# EAGLE design ssslidar_v1.0_blade_PWR_top (EAGLE 7.6.0)
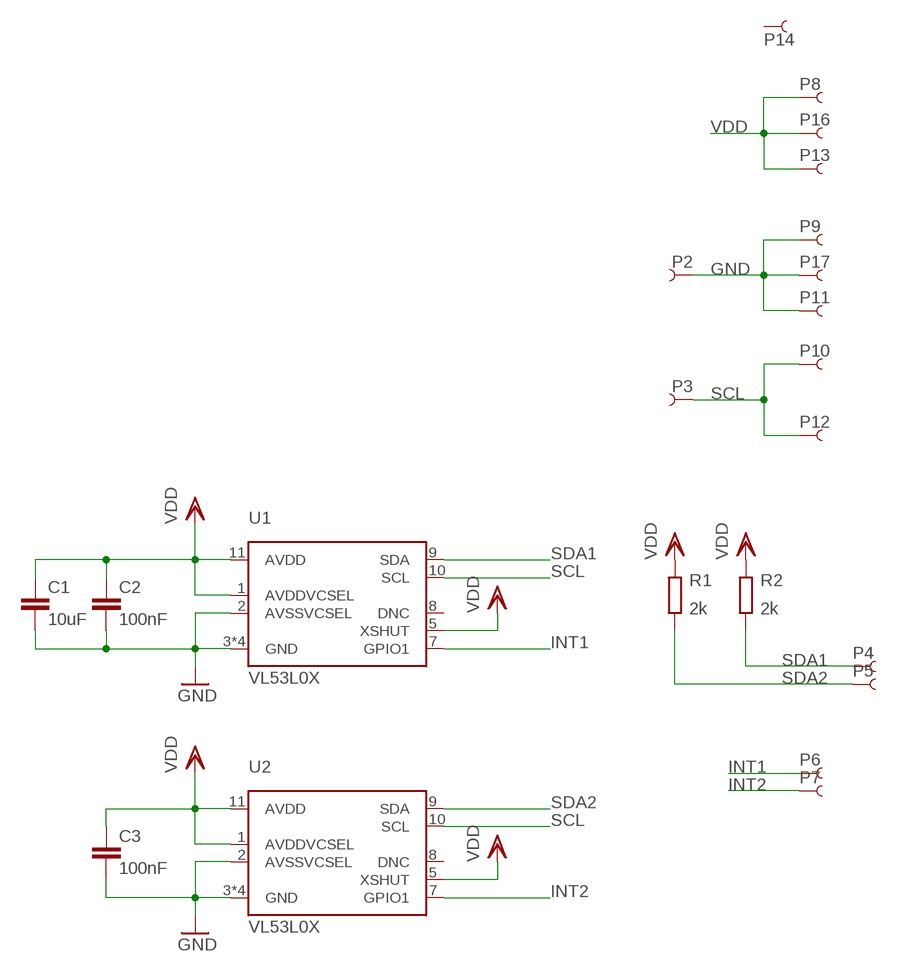
[diagram p0: schematic, sheet 1]

## Parts
C1  10uF  C0805  [0805_N]
C2  100nF  C0402  [0402_N]
C3  100nF  C0402  [0402_N]
P2  PIN_SMD_1X1_RECT  [PIN_SMD_1X1_RECT]
P3  PIN_SMD_0.8X1_RECT  [PIN_SMD_0.8X1_RECT]
P4  PIN_SMD_0.8X1_RECT  [PIN_SMD_0.8X1_RECT]
P5  PIN_SMD_0.8X1_RECT  [PIN_SMD_0.8X1_RECT]
P6  PIN_SMD_0.8X1_RECT  [PIN_SMD_0.8X1_RECT]
P7  PIN_SMD_0.8X1_RECT  [PIN_SMD_0.8X1_RECT]
P8  PIN_SMD_0.8X1_RECT  [PIN_SMD_0.8X1_RECT]
P9  PIN_SMD_1X1_RECT  [PIN_SMD_1X1_RECT]
P10  PIN_SMD_1X1_RECT  [PIN_SMD_1X1_RECT]
P11  PIN_SMD_1X2  [PIN_SMD_1X2]
P12  PIN_SMD_1X1_RECT  [PIN_SMD_1X1_RECT]
P13  PIN_SMD_1X1_RECT  [PIN_SMD_1X1_RECT]
P14  PIN_SMD_0.8X1_RECT  [PIN_SMD_0.8X1_RECT]
P16  PIN_SMD_1X1_RECT  [PIN_SMD_1X1_RECT]
P17  PIN_SMD_1X2  [PIN_SMD_1X2]
R1  2k  R0402  [0402_N]
R2  2k  R0402  [0402_N]
U1  VL53L0X  [VL53L0X]
U2  VL53L0X  [VL53L0X]

## Nets
GND: C1.2 C2.2 C3.2 P2.PIN P9.PIN P11.P$1 P17.P$1 U1.2(AVSSVCSEL) U1.3(GND) U1.4(GND) U1.6(GND) U1.12(GND) U2.2(AVSSVCSEL) U2.3(GND) U2.4(GND) U2.6(GND) U2.12(GND)
INT1: P6.PIN U1.7(GPIO1)
INT2: P7.PIN U2.7(GPIO1)
SCL: P3.PIN P10.PIN P12.PIN U1.10(SCL) U2.10(SCL)
SDA1: P4.PIN R2.1 U1.9(SDA)
SDA2: P5.PIN R1.1 U2.9(SDA)
VDD: C1.1 C2.1 C3.1 P8.PIN P13.PIN P16.PIN R1.2 R2.2 U1.1(AVDDVCSEL) U1.5(XSHUT) U1.11(AVDD) U2.1(AVDDVCSEL) U2.5(XSHUT) U2.11(AVDD)
Unconnected: P14.PIN U1.8(DNC) U2.8(DNC)

## Library data of the parts
C1-C3 = Xevelabs:C: Non-polarized Capacitor
P2-P14 P16 P17 = Xevelabs:PIN
R1 R2 = Xevelabs:R: Resistor
U1 U2 = VL53L0X:VL53L0X: VL53L0X distance sensor

## Board
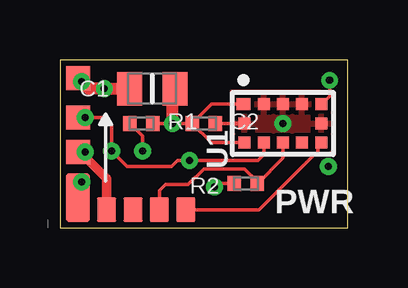
[diagram p1: board, top side]
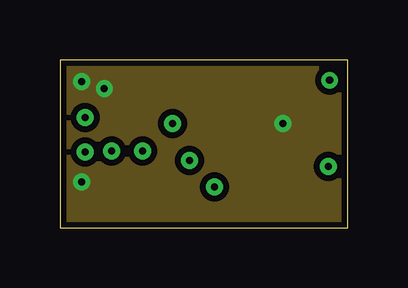
[diagram p2: board, inner layer Route2]
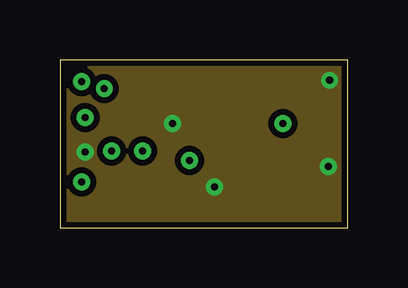
[diagram p3: board, inner layer Route3]
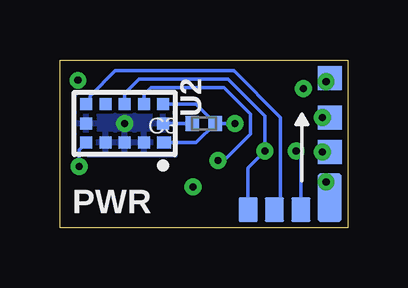
[diagram p4: board, bottom side, seen from below]

Size 12 x 7 mm. Coordinates in mm from the lower left corner, seen from the top.
Outline: 0,0 12,0 12,7 0,7 0,0
Copper layers (1*2*3*16): Top 0.035mm / dielectric 0.15mm / Route2 0.035mm / dielectric 1.1mm / Route3 0.035mm / dielectric 0.15mm / Bottom 0.035mm
Design rules "Xevelabs_6mil_4layers_eurocircuits": minimum track width 0.15mm, minimum drill 0.25mm, track to track 0.155mm, track to pad 0.155mm, pad to pad 0.155mm, via to via 0.155mm, smd to smd 0mil, copper to edge 0.25mm, drill to drill 0.25mm, minimum pad ring 0.15mm, minimum via ring 0.2mm, stop-mask expansion 0mil, vias tented up to drill 100mil, thermal gap 0.2mm

### Footprints (pad centres in the part's own frame; a part is rotated, then mirrored left to right if it is on the bottom)
0805_N = smd 1.05 x 1.4: 1 -0.95,0; 2 0.95,0
0402_N = smd 0.57 x 0.62: 1 -0.48,0; 2 0.48,0
PIN_SMD_1X1_RECT = smd 1 x 1: PIN 0,0
PIN_SMD_0.8X1_RECT = smd 1 x 0.8: PIN 0,0
PIN_SMD_1X2 = smd 2 x 1: P$1 0,0
VL53L0X = smd 0.5 x 0.58: 1 0.8,1.64 | smd 0.5 x 0.5: 2 0.8,0.8; 3 0.8,0; 4 0.8,-0.8; 5 0.8,-1.6; 6 0,-1.6; 7 -0.8,-1.6; 8 -0.8,-0.8; 9 -0.8,0; 10 -0.8,0.8; 11 -0.8,1.6; 12 0,1.6

### Placement (x,y rotation side)
C1  3.85,5.8 180 top
C2  6,4.35 0 top
C3  6,4.35 180 bottom
P2  0.75,6.25 90 bottom
P3  1.95,0.75 90 bottom
P4  4.15,0.75 90 top
P5  4.15,0.75 90 bottom
P6  5.25,0.75 90 top
P7  3.05,0.75 90 bottom
P8  1.95,0.75 90 top
P9  0.75,6.25 0 top
P10  0.75,4.6 180 bottom
P11  0.75,1.25 270 top
P12  0.75,4.6 0 top
P13  0.75,3.15 0 bottom
P14  3.05,0.75 90 top
P16  0.75,3.15 180 top
P17  0.75,1.25 270 bottom
R1  3.4,4.35 0 top
R2  7.75,1.85 180 top
U1  9.3,4.35 90 top
U2  9.3,4.35 270 bottom

### Tracks (layer width: path | path; a pad name or v marks a point on that pad's centre or on a via)
GND  (via drill 0.3)
  Top 0.15: P9.PIN v0.9,6.1 | C3.2 U2.12 | v0.9,1.9 0.9,1.4 P11.P$1
  Top 0.5: C1.2 v1.85,5.8 1.2,5.8 v0.9,6.1
  Bottom 0.15: P9.PIN v0.9,6.1 | U2.12 C3.2 | v0.9,1.9 0.9,1.4 P11.P$1
  other vias: 9.3,4.35
  pour Route2 (isolate 0.254): 0,7 12,7 12,0 0,0
  pour Top: 11.45,5.7 7.15,5.7 7.15,3 11.45,3
  pour Bottom: 11.45,5.7 7.15,5.7 7.15,3 11.45,3
INT1
  Top 0.15: U1.7 10.75,3.4 10.75,3.1 10.65,3.1 8.3,0.75 P6.PIN
INT2
  Bottom 0.15: U2.7 10.75,5.3 10.75,5.5 9.7,6.55 4.75,6.55 2.8,4.6 2.8,1 P7.PIN
SCL  (via drill 0.3)
  Top 0.15: P12.PIN v1.05,4.6 1.85,4.6 2.15,4.3 v2.15,3.2 2.8,2.55 4.65,2.55 4.9,2.8 v5.4,2.8 8.25,2.8 8.5,3.05 U1.10
  Bottom 0.15: P12.PIN v1.05,4.6 | U2.10 8.5,5.55 8.2,5.85 5.15,5.85 4.05,4.75 4.05,3.9 5.15,2.8 v5.4,2.8 | P3.PIN 1.95,3 v2.15,3.2
SDA1
  Top 0.15: U1.9 9.3,2.9 8.25,1.85 R2.1 8.23,1.92 7.7,2.45 6,2.45 5.35,1.8 4.4,1.8 4.15,1.55 P4.PIN
SDA2  (via drill 0.3)
  Top 0.15: R1.1 3.45,3.82 v3.45,3.2
  Bottom 0.15: U2.9 9.3,5.6 8.7,6.2 5,6.2 3.45,4.65 v3.45,3.2 4.15,2.5 P5.PIN
VDD  (via drill 0.3)
  Top 0.15: v1.05,3.15 P13.PIN | v11.25,6.15 11.25,5.5 U1.5 | 4.8,5.68 C1.1 | v6.45,1.7 6.6,1.85 R2.2 | U1.11 6.32,3.55 C3.1 | C3.1 v4.7,4.35 R1.2 | C3.1 6.32,5.15 U1.1
  Top 0.4: P8.PIN 1.95,2.05 1.05,2.95 v1.05,3.15
  Top 0.5: 4.8,5.65 C1.1 4.7,5.8 v4.7,4.35
  Bottom 0.15: P13.PIN v1.05,3.15 | U2.5 11.2,3.25 v11.2,2.55 | U2.11 6.32,5.15 C3.1 | U2.1 6.32,3.55 C3.1 | v4.7,4.35 C3.1
  pour Route3 (isolate 0.254): 0,7 12,7 12,0 0,0

### Text on the board
tPlace: PWR
bPlace: PWR